# Altium schematic sheet power_suppliers.SchDoc
size A4
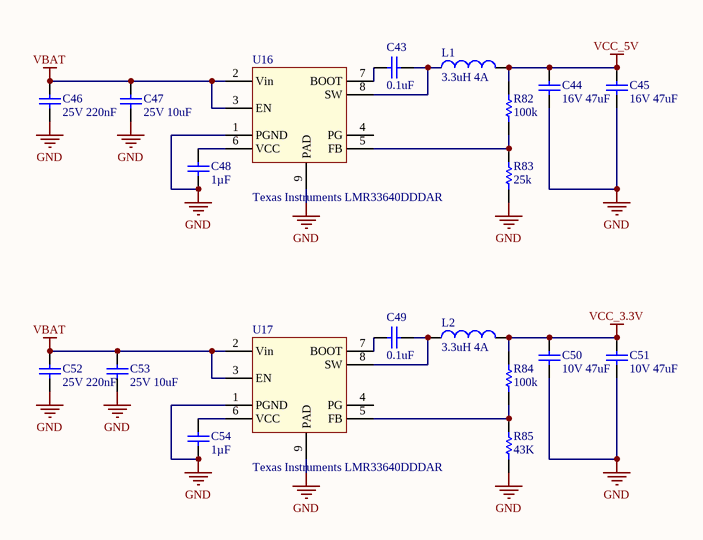
[diagram p0: power_suppliers.SchDoc]

## Parts
C43  0.1uF  [CAPC1608X90X35LL15T15]
C44  16V 47uF  [PCB-h26gble9h939l4c191wl-1]
C45  16V 47uF  [PCB-h26gble9h939l4c191wl-1]
C46  25V 220nF  [CAPC1608X90X35LL15T15]
C47  25V 10uF  [CAPC3225X279X50NL20T25]
C48  1µF  [CAPC1608X90X35ML15T15]
C49  0.1uF  [CAPC1608X90X35LL15T15]
C50  10V 47uF  [PCB-h26gble9h939l4c191wl-1]
C51  10V 47uF  [PCB-h26gble9h939l4c191wl-1]
C52  25V 220nF  [CAPC1608X90X35LL15T15]
C53  25V 10uF  [CAPC3225X279X50NL20T25]
C54  1µF  [CAPC1608X90X35ML15T15]
L1  3.3uH 4A  [PCB-nnnro8dea2m4q1g7ugdq-1]
L2  3.3uH 4A  [PCB-nnnro8dea2m4q1g7ugdq-1]
R82  100k  [RESC1608X55X30LL15T15]
R83  25k  [RESC1609X50X30LL10T20]
R84  100k  [RESC1608X55X30LL15T15]
R85  43K  [RESC1608X55X30LL15T15]
U16  Texas Instruments LMR33640DDDAR  [PCB-6od3ifqvrl04n4lmrw41-1]
U17  Texas Instruments LMR33640DDDAR  [PCB-6od3ifqvrl04n4lmrw41-1]

## Nets
GND: C44.2 C45.2 C46.1 C47.1 C48.2 C50.2 C51.2 C52.1 C53.1 C54.2 R83.1 R85.1 U16.1(PGND) U16.9(PAD) U17.1(PGND) U17.9(PAD)
VBAT: C46.2 C47.2 C52.2 C53.2 U16.2(Vin) U16.3(EN) U17.2(Vin) U17.3(EN)
VCC_3.3V: C50.1 C51.1 L2.2 R84.2
VCC_5V: C44.1 C45.1 L1.2 R82.2
NetC43_1: C43.1 U16.7(BOOT)
NetC43_2: C43.2 L1.1 U16.8(SW)
NetC48_1: C48.1 U16.6(VCC)
NetC49_1: C49.1 U17.7(BOOT)
NetC49_2: C49.2 L2.1 U17.8(SW)
NetC54_1: C54.1 U17.6(VCC)
NetR82_1: R82.1 R83.2 U16.5(FB)
NetR84_1: R84.1 R85.2 U17.5(FB)

Not connected (* = marked no-connect by the designer): U16 4(PG); U17 4(PG)

## Library data of the parts
C43 C49 = CMP-175023-2: Cap Ceramic 0.1uF 16V X7R 10% SMD 0603 125C Paper T/R; Manufacturer Part Number: 0603YC104K4T2A; Capacitance: 1e-07 F; Lead-Free Status: Lead Free; Voltage Rating (DC): 16.0 V; Capacitance Tolerance: ±10%; Case/Package: 0603; Dielectric Characteristic: X7R; Mounting Style: Surface Mount; Number of Pins: 2; Octopart Url: https://octopart.com/0603yc104k4t2a-avx+interconnect+%2F+elco-8120651; OctopartID: 8dfd448c41d0523a; Packaging: Tape; REACH SVHC Compliance: No SVHC; RoHS: Compliant
C44 C45 C50 C51 = CMP-cdd204dbeb8b1215-2: 1210 47 uF 10 V ±10% Tolerance X5R SMT Multilayer Ceramic Capacitor; Manufacturer Part Number: GRM32ER61A476KE20L; Capacitance: 47.0 µF; Voltage Rating (DC): 10.0 V; Case/Package (SI): 3225; Lead-Free Status: Lead Free; Size-Length: 3.20 mm; Packaging: Cut Tape (CT), Tape & Reel (TR); Size-Width: 2.50 mm; Size-Height: 2.50 mm; RoHS: Compliant; Dielectric Characteristic: X5R; Size-Thickness: 2.50 mm; Case/Package: 1210; Capacitance Tolerance: ±10%; Lifecycle Status: Active; REACH SVHC Compliance: No SVHC; Number of Pins: 2; OctopartID: cdd204dbeb8b1215; Mounting Style: Surface Mount; Octopart URL: http://octopart.com/grm32er61a476ke20l-murata-197439
C46 C52 = CMP-126800-2: CAP CER 0.22UF 25V 10% X5R 0603; Manufacturer Part Number: 06033D224KAT2A; Capacitance: 2.2e-07 F; Dielectric Material: Ceramic Multilayer; Lead-Free Status: Lead Free; Voltage Rating (DC): 25.0 V; Capacitance Tolerance: ±10%; Case/Package: 0603; Dielectric Characteristic: X5R; Mounting Style: Surface Mount; Number of Pins: 2; Octopart Url: https://octopart.com/06033d224kat2a-avx+interconnect+%2F+elco-194837; OctopartID: 9cd555dd40a64312; REACH SVHC Compliance: No SVHC; RoHS: Compliant; Size-Height: 0.00086 m; Size-Length: 0.0016 m; Size-Width: 0.00081 m
C47 C53 = CMP-127194-2: CAP CER 10UF 25V 10% X5R 1210; Manufacturer Part Number: 12103D106KAT2A; Capacitance: 1e-05 F; Dielectric Material: Ceramic Multilayer; Lead-Free Status: Lead Free; Voltage Rating (DC): 25.0 V; Capacitance Tolerance: ±10%; Case/Package: 1210; Dielectric Characteristic: X5R; Mounting Style: Surface Mount; Number of Pins: 2; Octopart Url: https://octopart.com/12103d106kat2a-avx+interconnect+%2F+elco-46506207; OctopartID: afcd64022a74700a; REACH SVHC Compliance: No SVHC; RoHS: Compliant; Size-Height: 0.00229 m; Size-Length: 0.0032 m; Size-Width: 0.0025 m
C48 C54 = CMP-f2f83b8d074c2d3f-6: 0603 1 uF 16 V ±10 % Tolerance X5R SMT Multilayer Ceramic Capacitor; Capacitance Tolerance: ±10%; Lead-Free Status: Lead Free; Voltage Rating (DC): 16.0 V; Dielectric Characteristic: X5R; Mounting Style: Surface Mount; OctopartID: f2f83b8d074c2d3f
L1 L2 = CMP-d4431d2f1dc30b84-1: Power inductor, shielded, 10/20/30% tol, SMT, RoHS; Manufacturer Part Number: MSS1048-683MLC; Lead-Free Status: Contains Lead; Inductance: 68.0 µH; Self Resonant Frequency: 7.00 MHz; Mounting Style: Surface Mount; Packaging: Cut Tape (CT), Tape & Reel (TR); OctopartID: d4431d2f1dc30b84; RoHS: Compliant; Octopart URL: https://octopart.com/mss1048-683mlc-coilcraft-6745318; Lifecycle Status: Active
R82 R84 = CMP-9abf51c576ad4578-20: Res General Purpose Thick Film 0603 100k Ohm 1% 1/10W ±100ppm/°C Molded Paper T/R
R83 = CMP-1857223-2: RES SMD 25.5K OHM 1% 1/10W 0603; Manufacturer Part Number: CRCW060325K5FKEA; Lead-Free Status: Lead Free; Power Rating: 0.1 W; Resistance: 25500.0 Ω; Temperature Coefficient: 100.0 ppm/°C; Voltage Rating (DC): 75.0 V; Case/Package: 0603; Mounting Style: Surface Mount; Number of Pins: 2; Octopart Url: https://octopart.com/crcw060325k5fkea-vishay-39836292; OctopartID: d1e11ab42e030e26; REACH SVHC Compliance: No SVHC; Resistance Tolerance: ±1%; RoHS: Compliant; Size-Height: 0.00045 m; Size-Length: 0.00155 m; Size-Width: 0.00085 m
R85 = CMP-3653524-2: Thick Film Resistors - SMD 0603 43Kohms 5% Tol; Manufacturer Part Number: ERJ-3GEYJ433V; Lead-Free Status: Lead Free; Power Rating: 0.1 W; Resistance: 43000.0 Ω; Voltage Rating (DC): 75.0 V; Case/Package: 0603; Lifecycle Status: Not Listed by Manufacturer; Mounting Style: Surface Mount; Octopart Url: https://octopart.com/erj-3geyj433v-panasonic-55422106; OctopartID: 0ae6c0a1831ad521; Packaging: Cut Tape (CT); REACH SVHC Compliance: No SVHC; Resistance Tolerance: ±5%; RoHS: Compliant; Size-Height: 0.00045 m; Size-Length: 0.0016 m; Size-Width: 0.0008 m
U16 U17 = CMP-bb02745c510e64c5-3: SIMPLE SWITCHER Synchronous Step-Down Converter 3.8V to 36V Input 4A 8-Pin SO PowerPAD T/R; OctopartID: bb02745c510e64c5